# EasyEDA Pro project Utsuwa_project.epro

# Schematic Schematic1
Board Name: Board1; Create Date: 2025-12-11; Page Name: P1; Project Name: Utsuwa; Schematic Name: Schematic1; Update Date: 2025-12-11; Company: EasyEDA.com; Page Size: A4; Version: V1.0
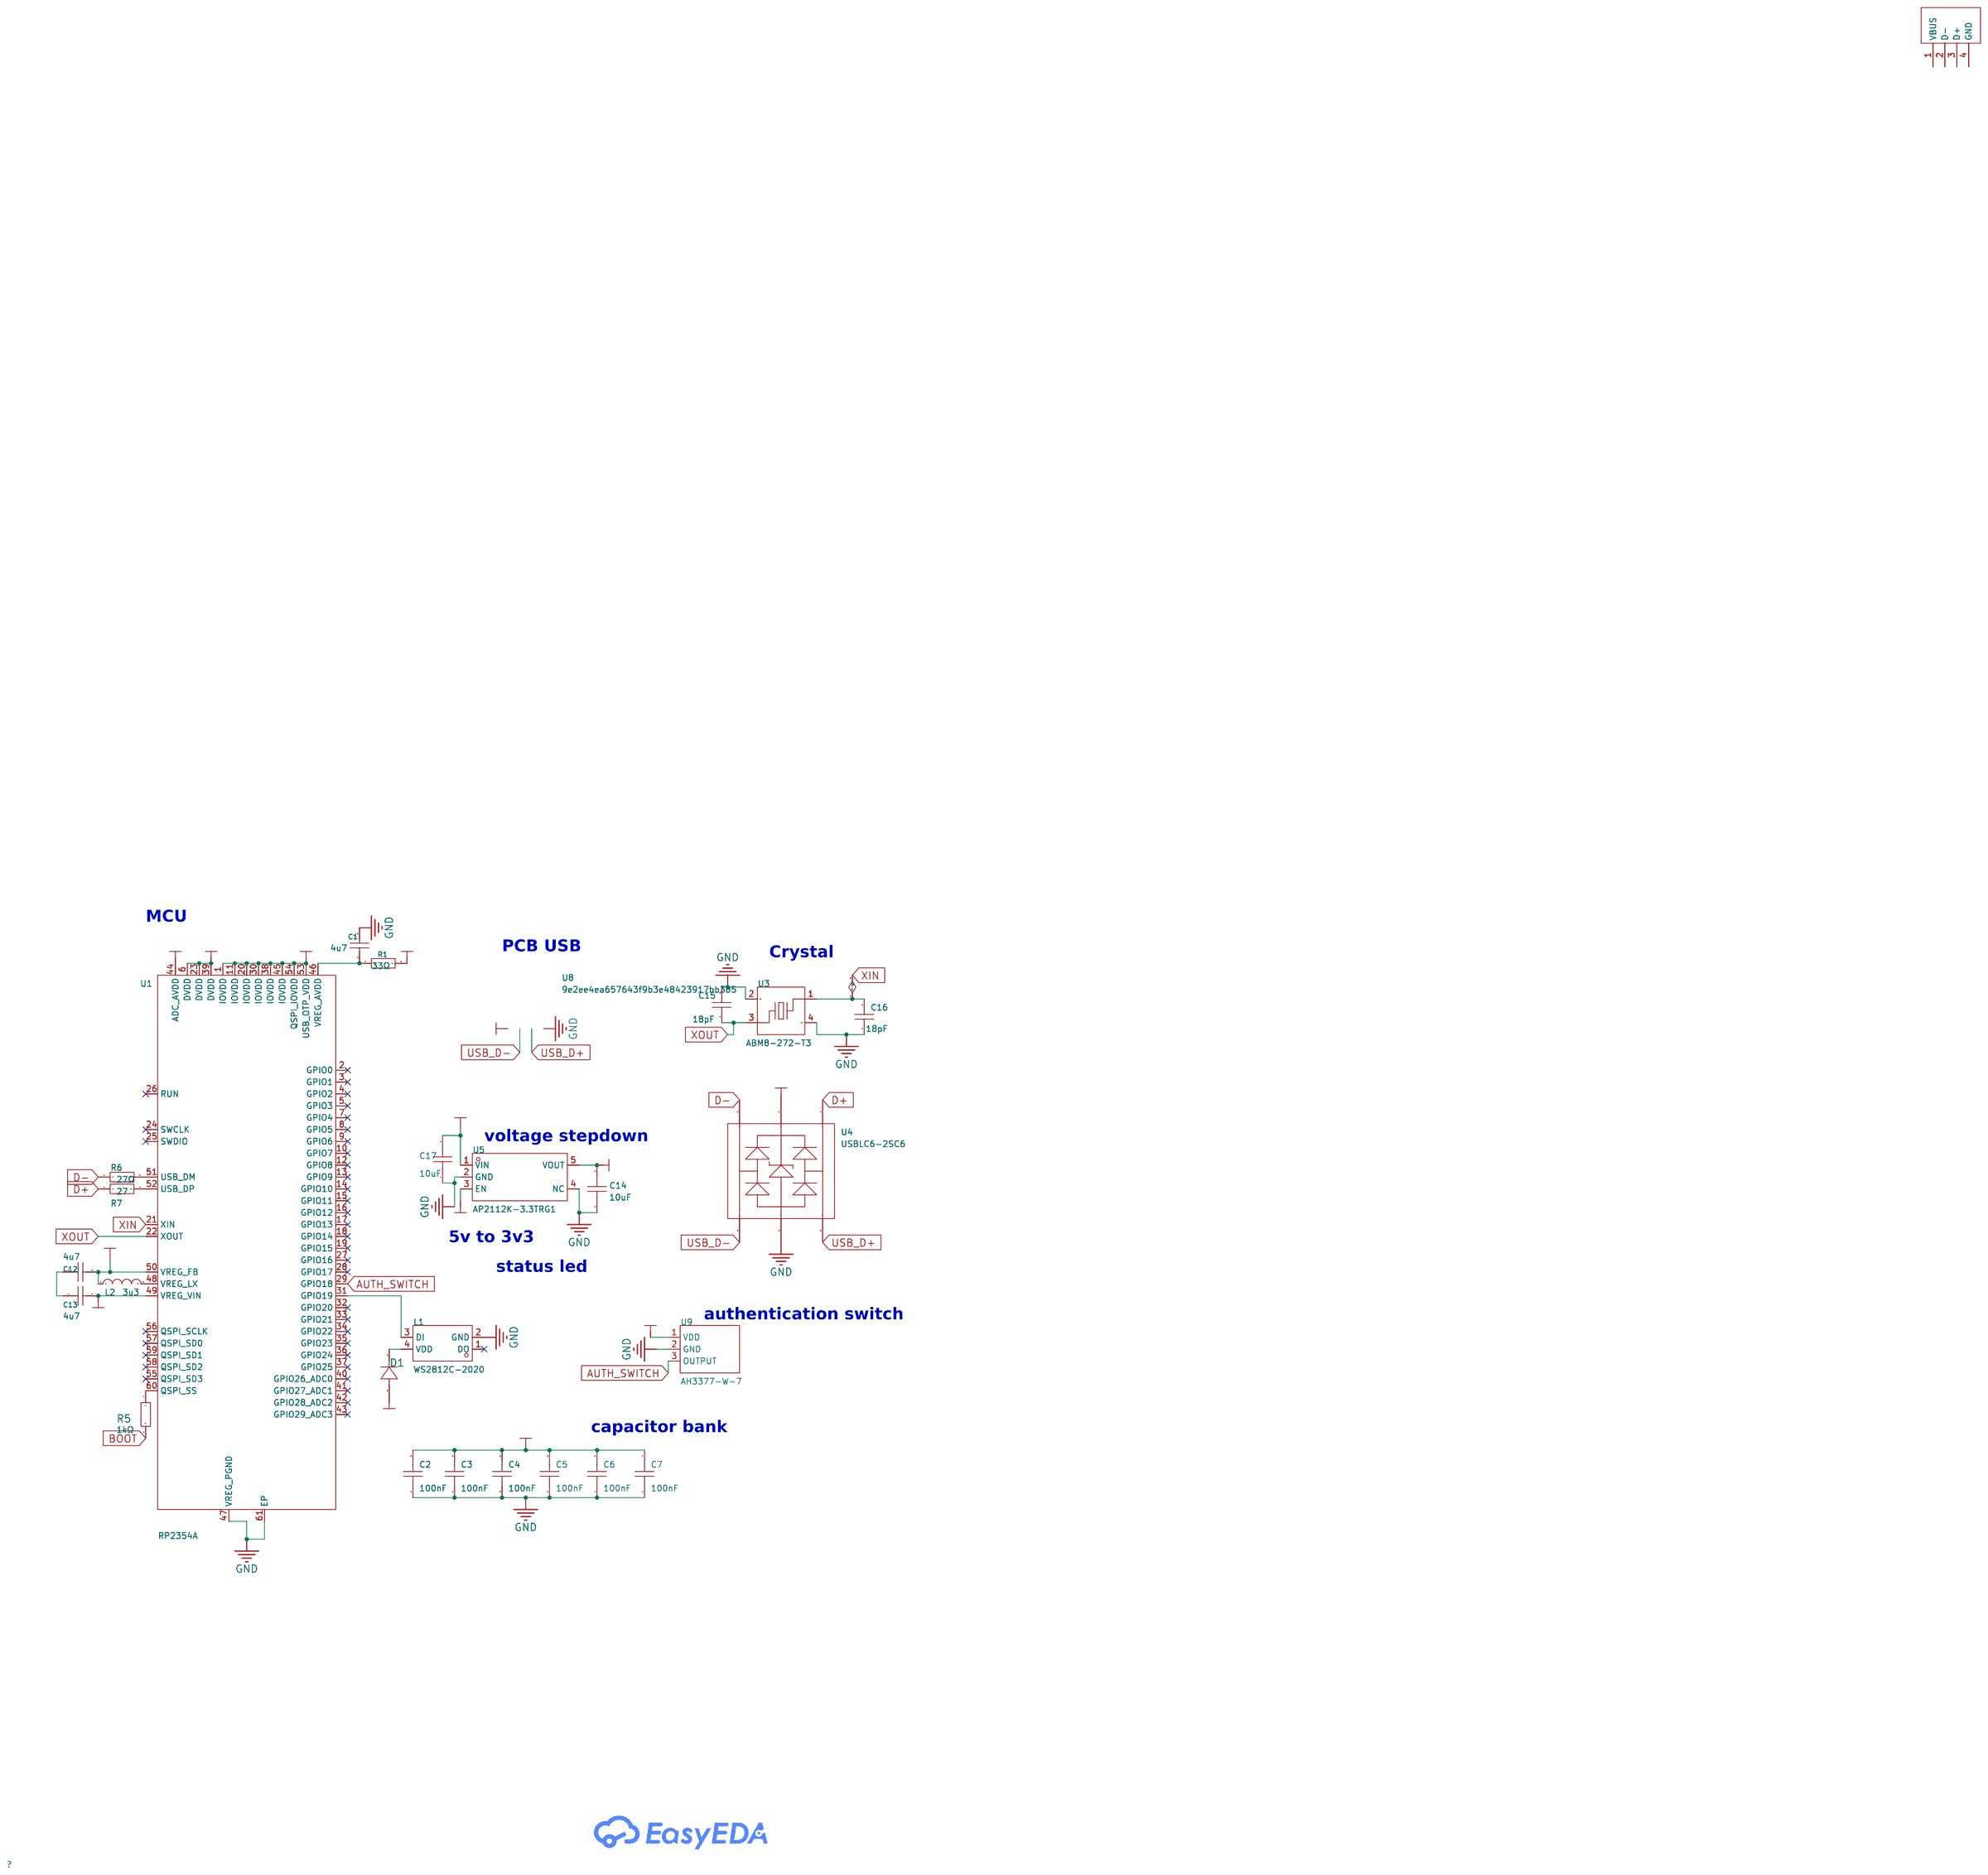
[diagram p0: schematic sheet]

## Parts
C1  4u7  [C0402_custom]
C2  100nF  [C0402_custom]
C3  100nF  [C0402_custom]
C4  100nF  [C0402_custom]
C5  100nF  [C0402_custom]
C6  100nF  [C0402_custom]
C7  100nF  [C0402_custom]
C12  4u7  [C0402_wider]
C13  4u7  [C0402_wider]
C14  10uF  [C0603]
C15  18pF  [C0402_custom]
C16  18pF  [C0402_custom]
C17  10uF  [C0603]
D1  1N4148WS  [SOD-323_L1.7-W1.3-LS2.7-RD]
L1  WS2812C-2020  [LED-SMD_L2.2-W2.0]
L2  3u3  [IND-SMD_L2.0-W1.6_AOTA-B201610S3R3-101-T]
R1  33Ω  [R0402]
R5  1kΩ  [R0402]
R6  27Ω  [R0402]
R7  27  [R0402]
U1  RP2354A  [QFN-60_L7.0-W7.0-P0.40-TL-EP3.4]
U3  ABM8-272-T3  [CRYSTAL-SMD_4P-L3.2-W2.5-BL]
U4  USBLC6-2SC6  [SOT-23-6_L2.9-W1.6-P0.95-LS2.8-BL]
U5  AP2112K-3.3TRG1  [SOT-25-5_L2.9-W1.6-P0.95-LS2.8-BL]
U8  9e2ee4ea657643f9b3e48423917bb385  [USB-A_PCB]
U9  AH3377-W-7  [SC-59-3_L3.0-W1.6-P0.95-LS2.9-BR-CW]

## Library data of the parts
C1 C12 C13 = CL05A475MP5NRNC: Capacitance:4.7uF Tolerance:±20% Tolerance:±20% Voltage Rating:10V Temperature Coefficient:X5R; LCSC Part Name: 4.7uF ±20% 10V; Supplier Part: C23733; Manufacturer: SAMSUNG(三星); Supplier Footprint: 0402; Datasheet: https://item.szlcsc.com/datasheet/CL05A475MP5NRNC/24469.html; Supplier: LCSC; Tolerance: ±20%; Voltage Rating: 10V; Temperature Coefficient: X5R
C2-C7 = CL05B104KO5NNNC: Capacitance:100nF Tolerance:±10% Tolerance:±10% Voltage Rating:16V Temperature Coefficient:X7R; LCSC Part Name: 100nF ±10% 16V; Supplier Part: C1525; Manufacturer: SAMSUNG(三星); Supplier Footprint: 0402; Datasheet: https://item.szlcsc.com/datasheet/CL05B104KO5NNNC/1877.html; Supplier: LCSC; Tolerance: ±10%; Voltage Rating: 16V; Temperature Coefficient: X7R
C14 C17 = CAP_0603: Supplier Footprint: 0603
C15 C16 = 0402CG150J500NT: Capacitance: Tolerance:±5% Tolerance:±5% Voltage Rated: Temperature Coefficient:; LCSC Part Name: 15pF ±5% 50V; Supplier Part: C1548; Manufacturer: FH(风华); Supplier Footprint: 0402; JLCPCB Part Class: Basic Part; Datasheet: https://atta.szlcsc.com/upload/public/pdf/source/20200305/C486355_26A10D38EF8C2A5C37091D0039909270.pdf; Supplier: LCSC; Tolerance: ±5%
D1 = 1N4148WS_C5381436: Voltage - DC Reverse(Vr):75V Current - Rectified:200mA; Supplier Part: C5381436; Manufacturer: FOSAN(富捷/富信); Supplier Footprint: SOD-323; JLCPCB Part Class: Extended Part; Datasheet: https://atta.szlcsc.com/upload/public/pdf/source/20230330/BED04A7599B1CD0FB6785C43972F2AE7.pdf; Supplier: LCSC; Voltage - DC Reverse(Vr): 75V; Current - Rectified: 200mA
L1 = WS2812C-2020: Wavelength:460nm；520nm；623nm Operating Temperature:-25℃~+85℃; Supplier Part: C965556; Manufacturer: worldsemi; Supplier Footprint: SMD,2x2mm; Datasheet: https://atta.szlcsc.com/upload/public/pdf/source/20201203/C965556_B52DCEA0E250ABD59F33ED24C4AD3075.pdf; Supplier: LCSC; Wavelength: 460nm；520nm；623nm; Operating Temperature: -25℃~+85℃
L2 = AOTA-B201610S3R3-101-T: Supplier Part: C42411119; Manufacturer: ABRACON; Supplier Footprint: 0806; Datasheet: https://item.szlcsc.com/datasheet/AOTA-B201610S3R3-101-T/44392932.html; Supplier: LCSC
R1 = 0402WGF330JTCE: Type:Thick Film Resistors Resistance:33Ω Tolerance:±1% Tolerance:±1% Power(Watts): Overload Voltage (Max): Temperature Coefficient:±100ppm/℃ Temperature Coefficient:±100ppm/℃ Operating Temperature Range:-55℃~+155℃ Operating Temperature Range:-55℃~+155℃; LCSC Part Name: 33Ω ±1% 62.5mW 厚膜电阻; Supplier Part: C25105; Manufacturer: UNI-ROYAL(厚声); Supplier Footprint: 0402; Datasheet: https://atta.szlcsc.com/upload/public/pdf/source/20200306/C422600_1E6D84923E4A46A82E41ADD87F860B5C.pdf; Supplier: LCSC; Type: Thick Film Resistors; Tolerance: ±1%; Temperature Coefficient: ±100ppm/℃; Operating Temperature Range: -55℃~+155℃
R5 = 0402WGF1001TCE: Type:Thick Film Resistors Resistance:1kΩ Tolerance:±1% Tolerance:±1% Power(Watts): Overload Voltage (Max): Temperature Coefficient:±100ppm/℃ Temperature Coefficient:±100ppm/℃ Operating Temperature Range:-55℃~+155℃ Operating Temperature Range:-55℃~+155℃; LCSC Part Name: 1kΩ ±1% 62.5mW 厚膜电阻; Supplier Part: C11702; Manufacturer: UNI-ROYAL(厚声); Supplier Footprint: 0402; JLCPCB Part Class: Basic Part; Datasheet: https://atta.szlcsc.com/upload/public/pdf/source/20200306/C422600_1E6D84923E4A46A82E41ADD87F860B5C.pdf; Supplier: LCSC; Type: Thick Film Resistors; Tolerance: ±1%; Temperature Coefficient: ±100ppm/℃; Operating Temperature Range: -55℃~+155℃
R6 = CR0402FF27R0G: Type:Thick Film Resistors Resistance: Tolerance:±1% Tolerance:±1% Power(Watts): Overload Voltage (Max): Temperature Coefficient:±200ppm/℃ Temperature Coefficient:±200ppm/℃ Operating Temperature Range:-55℃~+125℃ Operating Temperature Range:-55℃~+125℃; LCSC Part Name: 厚膜电阻 27Ω ±1% 62.5mW; Supplier Part: C100353; Manufacturer: LIZ(丽智电子); Supplier Footprint: 0402; JLCPCB Part Class: Extended Part; Datasheet: https://atta.szlcsc.com/upload/public/pdf/source/20180403/C189438_6D658388CC7843F35BBC9018D03F0B8E.pdf; Supplier: LCSC; Type: Thick Film Resistors; Tolerance: ±1%; Temperature Coefficient: ±200ppm/℃; Operating Temperature Range: -55℃~+125℃
R7 = Res_0603: Supplier Footprint: 0603
U1 = RP2354A: LCSC Part Name: 微控制器; Supplier Part: C41378174; Manufacturer: Raspberry Pi(树莓派); Supplier Footprint: QFN-60(7x7); Datasheet: https://item.szlcsc.com/datasheet/RP2354A/43147979.html; Supplier: LCSC
U3 = ABM8-272-T3_C20625731: Supplier Part: C20625731; Manufacturer: ABRACON; Supplier Footprint: SMD3225-4P; JLCPCB Part Class: Extended Part; Datasheet: https://item.szlcsc.com/datasheet/ABM8-272-T3/22032038.html; Supplier: LCSC
U4 = USBLC6-2SC6_C6807798: Polarity:Unidirectional Reverse Stand-Off Voltage (Vrwm):5V Clamping Voltage:10.4V Peak Pulse Current (Ipp):8A Peak Pulse Power Dissipation (Ppp):120W Voltage - Breakdown:9V Reverse Leakage Current (Ir):10nA Number of Channels:Three Channels Operating Tem; LCSC Part Name: 单向ESD; Supplier Part: C6807798; Manufacturer: FUXINSEMI(富芯森美); Supplier Footprint: SOT-23-6L; JLCPCB Part Class: Extended Part; Datasheet: https://atta.szlcsc.com/upload/public/pdf/source/20230621/E1164365F5EDB0C1523D3B709543B92D.pdf; Supplier: LCSC; Polarity: Unidirectional; Reverse Stand-Off Voltage (Vrwm): 5V; Clamping Voltage: 10.4V; Peak Pulse Current (Ipp): 8A; Peak Pulse Power Dissipation (Ppp): 120W; Voltage - Breakdown: 9V; Reverse Leakage Current (Ir): 10nA; Number of Channels: Three Channels; Operating Temperature: -55℃~+125℃; Type: ESD
U5 = AP2112K-3.3TRG1: Output Type:Fixed Maximum Input Voltage:6V Output Voltage:3.3V Output Voltage:3.3V Output Current:600mA Power Supply Rejection Ratio (PSRR):65dB@(1kHz) Dropout Voltage:400mV@(600mA) standby current:80uA Feature:ESD Protection；Automatic Discharge Function；; LCSC Part Name: 输入6V 输出3.3V 600mA; Supplier Part: C51118; Manufacturer: DIODES(美台); Supplier Footprint: SOT-25-5; JLCPCB Part Class: Extended Part; Datasheet: https://atta.szlcsc.com/upload/public/pdf/source/20171221/C51118_15138312998391195590.pdf; Supplier: LCSC; Output Type: Fixed; Maximum Input Voltage: 6V; Output Voltage: 3.3V; Output Current: 600mA; Power Supply Rejection Ratio (PSRR): 65dB@(1kHz); Dropout Voltage: 400mV@(600mA); standby current: 80uA; Feature: ESD Protection；Automatic Discharge Function；Low ESR；Thermal Protection(TSD)；Overcurrent Protection(OCP)；With ability; Operating Temperature: -40℃~+85℃; Output Polarity: Positive electrode; Number of Outputs: 1
U8 = USB-A_PCB
U9 = AH3377-W-7: Type:Unipolar Voltage - Supply:3V~28V Voltage - Supply:3V~28V Operation Points:11.5mT Operation Points:11.5mT Release Points:9mT Release Points:9mT Operating Temperature:-40℃~+125℃ Operating Temperature:-40℃~+125℃ Operating Current:3mA Output Type:Open Dr; LCSC Part Name: 高电压低灵敏度霍尔效应单极开关; Supplier Part: C842204; Manufacturer: DIODES(美台); Supplier Footprint: SC-59; JLCPCB Part Class: Extended Part; Datasheet: https://item.szlcsc.com/datasheet/AH3377-W-7/900535.html; Supplier: LCSC; Type: Unipolar; Voltage - Supply: 3V~28V; Operation Points: 11.5mT; Release Points: 9mT; Operating Temperature: -40℃~+125℃; Operating Current: 3mA; Output Type: Open Drain

## Nets
+1V1: C12.1 L2.1 U1.6(DVDD) U1.23(DVDD) U1.39(DVDD) U1.50(VREG_FB)
+3V3: C2.2 C3.2 C4.2 C5.2 C6.2 C7.2 C13.1 C14.1 R1.2 U1.1(IOVDD) U1.11(IOVDD) U1.20(IOVDD) U1.30(IOVDD) U1.38(IOVDD) U1.44(ADC_AVDD) U1.45(IOVDD) U1.49(VREG_VIN) U1.53(USB_OTP_VDD) U1.54(QSPI_IOVDD) U5.5(VOUT) U9.1(VDD)
GND: C1.1 C2.1 C3.1 C4.1 C5.1 C6.1 C7.1 C14.2 C15.2 C16.1 C17.1 L1.2(GND) U1.47(VREG_PGND) U1.61(EP) U3.2(GND) U3.4(GND) U4.2(GND) U5.2(GND) U5.4(NC) U9.2(GND)
VBUS: C17.2 D1.2(A) U4.5(VCC) U5.1(VIN) U5.3(EN)
AUTH_SWITCH: U1.29(GPIO18) U9.3(OUTPUT)
BOOT: R5.2
D+: R7.1 U4.4(I/O2)
D-: R6.1 U4.6(I/O1)
USB_D+: U4.3(I/O2)
USB_D-: U4.1(I/O1)
XIN: C16.2 U1.21(XIN) U3.1
XOUT: C15.1 U1.22(XOUT) U3.3
$1N2088: C1.2 R1.1 U1.46(VREG_AVDD)
$1N2309: C12.2 C13.2
$1N2310: L2.2 U1.48(VREG_LX)
$1N2528: R5.1 U1.60(QSPI_SS)
$1N2666: R6.2 U1.51(USB_DM)
$1N2692: R7.2 U1.52(USB_DP)
$1N3054: D1.1(C) L1.4(VDD)
$1N3383: L1.3(DI) U1.31(GPIO19)

Not connected (* = marked no-connect by the designer): L1 1(DO)*; U1 2(GPIO0)* 3(GPIO1)* 4(GPIO2)* 5(GPIO3)* 7(GPIO4)* 8(GPIO5)* 9(GPIO6)* 10(GPIO7)* 12(GPIO8)* 13(GPIO9)* 14(GPIO10)* 15(GPIO11)* 16(GPIO12)* 17(GPIO13)* 18(GPIO14)* 19(GPIO15)* 24(SWCLK)* 25(SWDIO)* 26(RUN)* 27(GPIO16)* 28(GPIO17)* 32(GPIO20)* 33(GPIO21)* 34(GPIO22)* 35(GPIO23)* 36(GPIO24)* 37(GPIO25)* 40(GPIO26_ADC0)* 41(GPIO27_ADC1)* 42(GPIO28_ADC2)* 43(GPIO29_ADC3)* 55(QSPI_SD3)* 56(QSPI_SCLK)* 57(QSPI_SD0)* 58(QSPI_SD2)* 59(QSPI_SD1)*; U8 1(VBUS) 2(D-) 3(D+) 4(GND)

## Notes on the sheet
- MCU
- PCB USB
- Crystal
- voltage stepdown
- 5v to 3v3
- status led
- authentication switch
- capacitor bank

# Board PCB1
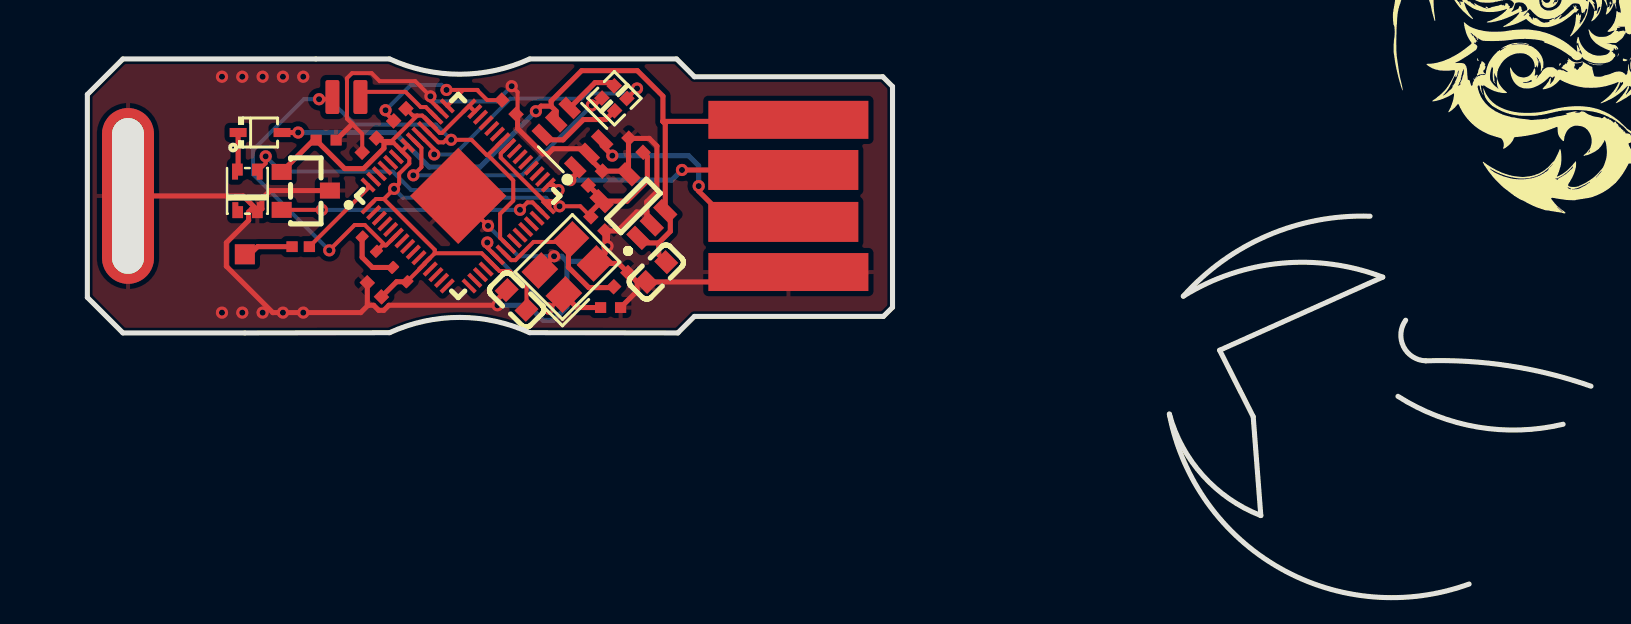
[diagram p1: board, top side]
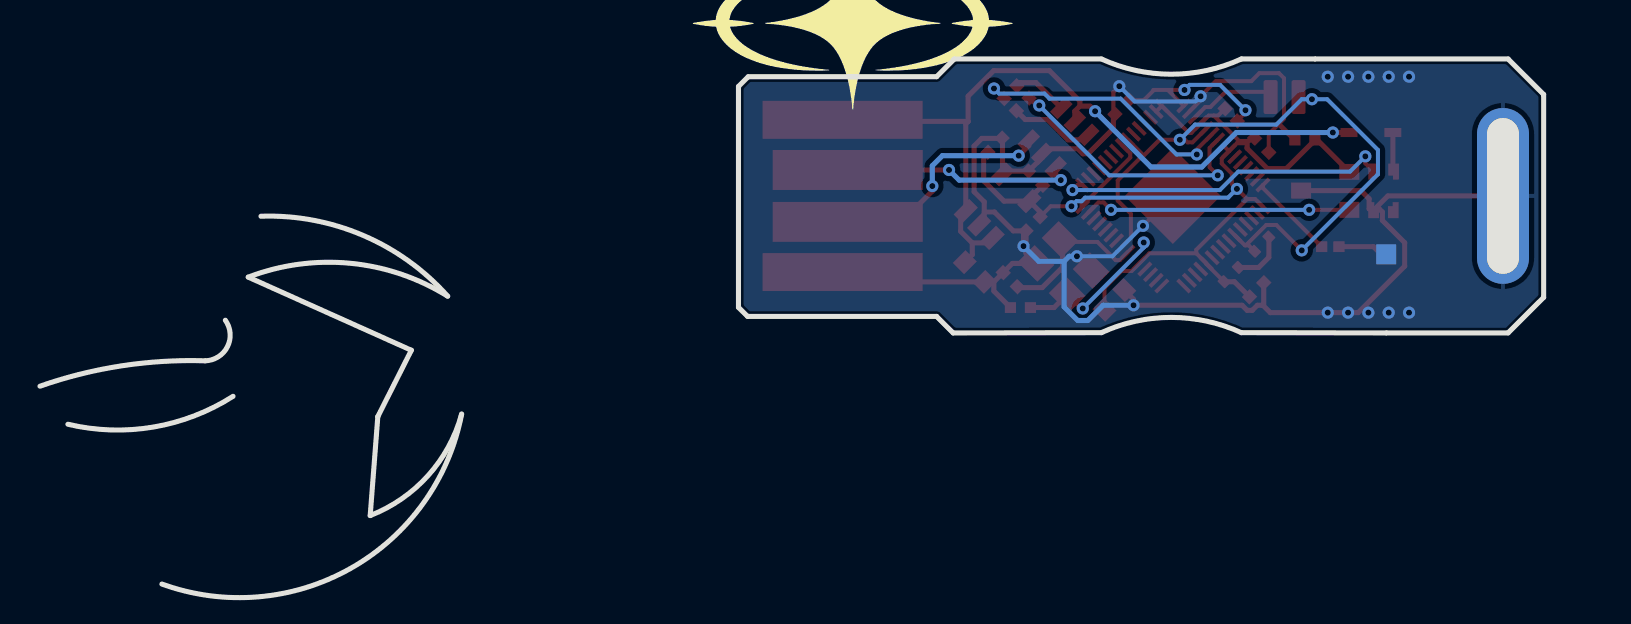
[diagram p2: board, bottom side, seen from below]

Outline 75.18 x 26.97 mm; copper layers: Top Layer, Bottom Layer. Coordinates in mm from the lower left corner of the outline.
Outline path: 64.14,19.1 arc(58.98,18.12) 54.8,15.09 arc(59.71,16.74) 64.77,16.05 56.62,12.39 58.29,9.06 58.67,4.11 arc(55.78,6.11) 54.1,9.19 arc(59.63,1.48) 69.09,0.68 ; 65.92,13.89 arc(65.81,12.57) 66.93,11.86 arc(71.11,11.6) 75.18,10.59 ; 73.79,8.68 arc(69.52,8.54) 65.53,10.08 ; 0,25.19 0,15.03 1.78,13.25 7.87,13.25 15.11,13.27 arc(18.61,14.03) 22.12,13.27 29.53,13.25 30.35,14.08 39.8,14.08 40.26,14.54 40.26,25.59 39.77,26.08 30.35,26.08 29.46,26.97 22.12,26.97 arc(18.61,26.2) 15.11,26.97 1.78,26.97 0,25.19
Stack: Top Layer 0.035mm / Dielectric1 1.51mm FR4 er 4.5 / Bottom Layer 0.035mm

## Design rules (mm)
template: JLCPCB Capability(Two Layers Board)
spacing copperThickness1oz (default): track to track 0.102, other pairs 0.152 to 0.3
spacing copperThickness2oz: track to track 0.203, other pairs 0.152 to 0.3
track width copperThickness1oz (default): min 0.127, default 0.254, max 2.54
track width copperThickness2oz: min 0.203, default 0.254, max 2.54
differential pair differentialPair (default): width min 0.127, default 0.254, max 2.54; gap min 0.152, default 0.152
via viaSize (default): diameter min 0.5, default 0.61, max 10; hole min 0.3, default 0.305, max 6.3

## Placement (name value [footprint] x y rotation side)
C1  4u7  [C0402_custom]  21.08 24.56 135 top
C2  100nF  [C0402_custom]  25.4 21 225 top
C3  100nF  [C0402_custom]  14.1 22.65 45 top
C4  100nF  [C0402_custom]  25.53 18.71 135 top
C5  100nF  [C0402_custom]  14.35 15.41 315 top
C6  100nF  [C0402_custom]  27.43 22.65 315 top
C7  100nF  [C0402_custom]  11.94 22.91 180 top
C12  4u7  [C0402_wider]  14.1 17.7 135 top
C13  4u7  [C0402_wider]  15.62 16.17 135 top
C14  10uF  [C0603]  21.46 14.9 135 top
C15  18pF  [C0402_custom]  26.67 15.92 45 top
C16  18pF  [C0402_custom]  26.16 14.52 180 top
C17  10uF  [C0603]  28.45 16.3 45 top
D1  1N4148WS  [SOD-323_L1.7-W1.3-LS2.7-RD]  8.64 23.29 0 top
L1  WS2812C-2020  [LED-SMD_L2.2-W2.0]  8 20.37 270 top
L2  3u3  [IND-SMD_L2.0-W1.6_AOTA-B201610S3R3-101-T]  12.95 25.06 0 top
NOREF  -  [Pad_e398]  7.87 17.19 0 top
NOREF#2  -  [Pad_e424]  2.03 20.11 90 top
R1  33Ω  [R0402]  15.62 24.18 45 top
R5  1kΩ  [R0402]  10.67 17.57 180 top
R6  27Ω  [R0402]  26.67 24.68 45 top
R7  27  [R0402]  26.03 25.32 225 top
U1  RP2354A  [QFN-60_L7.0-W7.0-P0.40-TL-EP3.4]  18.54 20.11 45 top
U3  ABM8-272-T3  [CRYSTAL-SMD_4P-L3.2-W2.5-BL]  24 16.56 45 top
U4  USBLC6-2SC6  [SOT-23-6_L2.9-W1.6-P0.95-LS2.8-BL]  24.26 23.03 45 top
U5  AP2112K-3.3TRG1  [SOT-25-5_L2.9-W1.6-P0.95-LS2.8-BL]  27.31 19.6 45 top
U8  9e2ee4ea657643f9b3e48423917bb385  [USB-A_PCB]  30.86 20.11 0 top
U9  AH3377-W-7  [SC-59-3_L3.0-W1.6-P0.95-LS2.9-BR-CW]  10.92 20.37 180 top

## Footprints (pads in the part's own frame, mm; a bottom-side part is the same pattern mirrored in y, then rotated)
C0402_custom
  rect 0.56x0.54 smd: 1(-0.5,0) 2(0.5,0)
C0402_wider
  rrect 0.45x0.53 smd: 1(-0.505,0) 2(0.505,0)
C0603
  rect 0.8x0.9 smd: 1(-0.7,0) 2(0.7,0)
CRYSTAL-SMD_4P-L3.2-W2.5-BL
  rect 1.4x1.2 smd: 1(-1.1,-0.85) 2(1.1,-0.85) 3(1.1,0.85) 4(-1.1,0.85)
IND-SMD_L2.0-W1.6_AOTA-B201610S3R3-101-T
  rrect 0.7x1.7 smd: 1(-0.7,0) 2(0.7,0)
LED-SMD_L2.2-W2.0
  custom 0.8x0.536 smd: 1(0.965,-0.485) 3(-0.966,0.5)
  custom 0.802x0.535 smd: 2(0.965,0.5)
  custom 0.8x0.535 smd: 4(-0.966,-0.5)
Pad_e398
  rect 1x1 hole 0.003: 8(0,0)
Pad_e424
  oval 8.8x2.6 hole 7.8x1.6: 8(0,0)
QFN-60_L7.0-W7.0-P0.40-TL-EP3.4
  rect 0.875x0.2 smd: 1(-3.575,2.8) 2(-3.575,2.4) 3(-3.575,2) 4(-3.575,1.6) 5(-3.575,1.2) 6(-3.575,0.8) 7(-3.575,0.4) 8(-3.575,0) 9(-3.575,-0.4) 10(-3.575,-0.8) 11(-3.575,-1.2) 12(-3.575,-1.6) 13(-3.575,-2) 14(-3.575,-2.4) 15(-3.575,-2.8) 31(3.575,-2.8) 32(3.575,-2.4) 33(3.575,-2.001) 34(3.575,-1.6) 35(3.575,-1.2) 36(3.575,-0.8) 37(3.575,-0.4) 38(3.575,-0.001) 39(3.575,0.4) 40(3.575,0.8) 41(3.575,1.2) 42(3.575,1.6) 43(3.575,2) 44(3.575,2.4) 45(3.575,2.8)
  rect 0.2x0.875 smd: 16(-2.8,-3.575) 17(-2.4,-3.575) 18(-2,-3.575) 19(-1.6,-3.575) 20(-1.2,-3.575) 21(-0.8,-3.575) 22(-0.4,-3.575) 23(0,-3.575) 24(0.4,-3.575) 25(0.8,-3.575) 26(1.2,-3.575) 27(1.6,-3.575) 28(2,-3.575) 29(2.4,-3.575) 30(2.8,-3.575) 46(2.8,3.575) 47(2.4,3.575) 48(2,3.575) 49(1.6,3.575) 50(1.2,3.575) 51(0.8,3.575) 52(0.4,3.575) 53(0,3.575) 54(-0.4,3.575) 55(-0.8,3.575) 56(-1.2,3.575) 57(-1.6,3.575) 58(-2,3.575) 59(-2.4,3.575) 60(-2.8,3.575)
  rect 3.4x3.4 smd: 61(0,0)
R0402
  rect 0.566x0.54 smd: 1(-0.433,0) 2(0.433,0)
SC-59-3_L3.0-W1.6-P0.95-LS2.9-BR-CW
  rect 1x0.8 smd: 1(1.206,-0.95) 2(-1.206,-0.015) 3(1.206,0.95)
SOD-323_L1.7-W1.3-LS2.7-RD
  rect 0.845x0.455 smd: 1(-1.097,0) 2(1.097,0)
SOT-23-6_L2.9-W1.6-P0.95-LS2.8-BL
  rect 0.532x1.072 smd: 1(-0.95,-1.149) 2(0,-1.149) 3(0.95,-1.149) 4(0.95,1.149) 5(0,1.149) 6(-0.95,1.149)
SOT-25-5_L2.9-W1.6-P0.95-LS2.8-BL
  rect 0.623x1.105 smd: 1(-0.95,-1.3) 2(-0.001,-1.3) 3(0.95,-1.3) 4(0.95,1.3) 5(-0.95,1.3)
USB-A_PCB
  rect 8x1.9 smd: 1(4.191,3.81) 4(4.191,-3.81)
  rect 7.5x2 smd: 2(3.937,1.3) 3(3.937,-1.3)

## Nets
+1V1: C12.1 L2.1 U1.6 U1.23 U1.39 U1.50
+3V3: C2.2 C3.2 C4.2 C5.2 C6.2 C7.2 C13.1 C14.1 R1.2 U1.1 U1.11 U1.20 U1.30 U1.38 U1.44 U1.45 U1.49 U1.53 U1.54 U5.5 U9.1
GND: C1.1 C2.1 C3.1 C4.1 C5.1 C6.1 C7.1 C14.2 C15.2 C16.1 C17.1 L1.2 NOREF#2.8 U1.47 U1.61 U3.2 U3.4 U4.2 U5.2 U5.4 U8.4 U9.2
VBUS: C17.2 D1.2 U4.5 U5.1 U5.3 U8.1
AUTH_SWITCH: U1.29 U9.3
BOOT: NOREF.8 R5.2
D+: R7.1 U4.4
D-: R6.1 U4.6
USB_D+: U4.3 U8.3
USB_D-: U4.1 U8.2
XIN: C16.2 U1.21 U3.1
XOUT: C15.1 U1.22 U3.3
$1N2088: C1.2 R1.1 U1.46
$1N2309: C12.2 C13.2
$1N2310: L2.2 U1.48
$1N2528: R5.1 U1.60
$1N2666: R6.2 U1.51
$1N2692: R7.2 U1.52
$1N3054: D1.1 L1.4
$1N3383: L1.3 U1.31

Pads without a net: L1 1; U1 2 3 4 5 7 8 9 10 12 13 14 15 16 17 18 19 24 25 26 27 28 32 33 34 35 36 37 40 41 42 43 55 56 57 58 59

## Via types
v1: diameter 0.61, hole 0.305, Top Layer to Bottom Layer, 39 vias

## Routing (per net, layer and track width the routed paths; a pad name or vN(x,y) marks a point on that pad's centre or on a via; arc(x,y) is an arc through that point)
+1V1: length 34.6
  Top Layer w0.2: v1(12.09,17.39) 13.36,18.66 13.87,18.66 14.89,17.64 ; 21.07,17.58 20.64,18.02 20.64,19.22 21.3,19.87 21.3,20.89 20.03,22.16 ; 20.03,22.16 U1.39 ; 20.03,22.16 19.97,22.16 19.21,22.92 17.94,22.92 17.81,22.79 17.56,22.79 U1.50 ; 14.89,17.64 14.75,17.64 14.45,17.34 ; 14.89,17.64 14.94,17.64 U1.6 ; v1(11.59,24.95) 12.14,24.95 L2.1
  Bottom Layer w0.2: v1(12.09,17.39) 8.28,21.2 8.28,22.41 10.82,24.95 v1(11.59,24.95) 12.09,24.95 13.36,23.68 17.43,23.68 v1(18.19,22.92)
+3V3: length 55.5
  Top Layer w0.2: 17.37,17.24 17.37,17.42 14.83,19.96 ; 17.37,17.24 U1.11 16.86,16.7 15.98,15.82 ; 17.37,17.24 19.72,17.24 U1.20 20.6,16.35 21.11,16.35 21.96,15.51 C14.1 ; U1.54 15.34,22.75 ; U1.54 16.01,22.64 ; U1.54 16.1,21.99 16.1,21.73 15.59,21.23 15.59,20.72 v1(15.34,20.46) 14.83,19.96 ; 15.34,22.75 14.83,22.75 ; 15.34,22.75 15.22,22.86 ; R1.2 16.27,24.13 16.49,24.13 ; 23.1,19.85 22.85,19.85 20.67,22.03 20.67,22.24 21.07,22.64 ; 23.1,19.85 23.36,19.85 v1(23.61,19.59) 24.65,19.59 C4.2 ; 23.1,19.85 23.1,19.62 U1.30 ; 17.11,23.77 U1.49 ; 17.11,23.77 17.62,23.26 17.73,23.26 19.09,24.62 U1.44 ; 17.11,23.77 16.75,24.13 16.49,24.13 ; 16.49,24.13 15.22,22.86 ; 14.03,19.56 14.43,19.96 14.83,19.96 ; 15.22,22.86 14.72,22.86 14.57,23 C3.2
  Top Layer w0.254: 25.71,19.85 25.71,19.98 C2.2 ; 25.71,19.85 26.98,19.85 28,20.87 28,22.08 C6.2 ; 25.71,19.85 25.17,19.31 C4.2 ; C5.2 15.46,15.82 15.98,15.82 ; 14.83,22.75 14.83,22.5 13.81,21.48 12.86,21.48 C7.2 11.31,22.91 U9.1
  Bottom Layer w0.2: v1(15.34,20.46) 15.78,20.03 22.92,20.03 23.1,19.85 23.36,19.85 v1(23.61,19.59)
GND: length 97.5
  Top Layer w0.2: C3.1 13.74,23.21 12.98,23.97 12.98,26.01 13.24,26.26 14.21,26.26 14.61,25.86 16.39,25.86 v1(17.15,25.1) 17.15,24.89 U1.47 ; v1(21.22,25.61) 21.51,25.31 21.51,24.12 ; v1(20.03,18.61) U1.61
  Top Layer w0.254: 28.22,18.68 27.97,18.94 27.97,19.31 ; 26.01,18.36 C4.1 25.88,17.23 U3.2 26.57,16.73 C15.2 27.49,15.81 ; 26.01,18.36 26.52,18.36 27.46,19.31 27.97,19.31 ; 26.01,18.36 v1(26.01,17.6) ; 27.49,15.81 C17.1 34.56,15.81 U8.4 ; 27.49,15.81 27.49,15.35 C16.1 ; C7.1 13.24,23.7 13.24,23.72 ; 14.05,14.65 14,14.7 C5.1 ; 14.05,14.65 14.06,14.64 14.32,14.64 14.57,14.38 14.82,14.38 15.08,14.64 v1(20.51,14.64) 20.51,14.94 C14.2 ; 14.05,14.65 13.67,14.27 v1(10.8,14.27) v1(9.78,14.27) 9.27,14.27 6.95,16.59 6.95,17.77 8.06,18.88 8.06,19.31 8.22,19.46 8.44,19.46 ; 8.44,19.46 8.56,19.46 ; 8.44,19.46 L1.2 8.56,19.46 ; 8.44,19.46 7.79,20.11 NOREF#2.8 ; 8.56,19.46 8.73,19.46 8.73,19.97 9.14,20.38 U9.2 ; 27.97,19.31 27.97,19.82 28.48,20.32 28.48,22.61 28.09,22.99 27.08,22.99 ; C1.1 21.51,24.12 21.51,23.49 22.78,22.22 23.04,22.22 23.29,22.47 24.82,22.47 U4.2 25.07,22.04 C2.1 26.9,21.35 U5.4 27.06,22.97 27.08,22.99 ; 27.08,22.99 C6.1 ; v1(23.34,17.09) 22.62,16.38
  Bottom Layer w0.2: v1(17.15,25.1) 17.41,24.84 20.46,24.84 v1(21.22,25.61) ; v1(20.03,18.61) 21.56,17.09 v1(23.34,17.09)
  Bottom Layer w0.254: v1(23.34,17.09) 23.72,17.09 23.97,16.84 ; 23.97,16.84 23.97,14.55 23.3,13.88 22.79,13.88 22.03,14.64 v1(20.51,14.64) ; 23.97,16.84 25.25,16.84 v1(26.01,17.6)
  vias: v1(6.73,26.08) v1(6.73,14.27) v1(7.75,26.08) v1(7.75,14.27) v1(8.76,26.08) v1(8.76,14.27) v1(9.78,26.08) v1(10.8,26.08)
VBUS: length 39.6
  Top Layer w0.254: 28.57,17.76 27.81,17.76 U5.1 ; 28.57,17.76 29.15,18.34 29.15,19.1 U5.3 28.9,23.72 28.78,23.84 28.78,23.84 ; 28.57,17.76 28.57,17.17 C17.2 ; U4.5 23.44,24.35 23.19,24.61 ; 28.78,23.84 28.78,25.11 27.5,26.38 24.71,26.38 23.19,24.86 23.19,24.61 ; 28.78,23.84 34.98,23.84 U8.1 ; 23.19,24.61 22.68,24.61 v1(22.43,24.35) ; v1(10.54,23.29) D1.2
  Bottom Layer w0.254: v1(22.43,24.35) 19.63,21.56 17.09,21.56 15.37,23.29 v1(10.54,23.29)
AUTH_SWITCH: length 13.4
  Top Layer w0.2: v1(21.63,19.42) 22,19.79 22.26,19.79 U1.29 ; v1(11.73,19.42) U9.3
  Bottom Layer w0.2: v1(21.63,19.42) v1(11.73,19.42)
BOOT: length 2.3
  Top Layer w0.254: 8.13,17.19 8.51,17.57 R5.2
D+: length 2.8
  Top Layer w0.254: R7.1 26.18,25.79 25.39,25.79 U4.4
D-: length 4.3
  Top Layer w0.254: 26.36,24.38 25.92,23.94 24.8,23.94 23.79,22.92 23.03,22.92 22.77,23.17
USB_D+: length 11.6
  Top Layer w0.254: 25.74,22.89 25.74,22.64 v1(26.25,22.13) ; v1(30.57,20.61) 30.57,20.35 32.09,18.83 34.78,18.83 34.8,18.81
  Bottom Layer w0.254: v1(26.25,22.13) 30.06,22.13 30.57,21.62 v1(30.57,20.61)
USB_D-: length 11.6
  Top Layer w0.254: v1(29.73,21.41) 34.8,21.41 ; U4.1 24.4,21.16 v1(24.14,20.9)
  Bottom Layer w0.254: v1(24.14,20.9) 29.22,20.9 v1(29.73,21.41)
XIN: length 8.7
  Top Layer w0.2: v1(23.04,14.48) 23.13,14.48 23.83,15.18 ; U1.21 20,17.53 v1(20,17.78)
  Top Layer w0.254: 23.83,15.18 24.48,14.52 C16.2
  Bottom Layer w0.2: v1(23.04,14.48) 20,17.53 v1(20,17.78)
XOUT: length 8
  Top Layer w0.2: 24.18,17.93 24.05,17.81 22.31,17.81 21.4,16.9 21.19,16.9 U1.22
  Top Layer w0.254: C15.1 26.27,15.52 25.07,15.52 24.05,16.54 24.05,17.81
$1N2088: length 8.5
  Top Layer w0.2: C1.2 19.99,24.91 19.48,25.42 ; U1.46 18.76,25.38 ; 19.48,25.42 v1(17.96,25.42) ; 19.48,25.42 19.52,25.42 ; 15.32,23.87 14.91,24.27 v1(14.91,24.4)
  Bottom Layer w0.2: v1(17.96,25.42) 17.7,25.67 16.18,25.67 v1(14.91,24.4)
$1N2309: length 2.8
  Top Layer w0.254: 15.26,16.53 14.25,16.53 13.74,17.04 13.74,18.06
$1N2310: length 4.4
  Top Layer w0.2: U1.48 16.92,24.56 16.67,24.56 15.9,25.32 13.91,25.32 L2.2
$1N2528: length 4.3
  Top Layer w0.2: 14.03,20.66 14.03,20.5 R5.1
$1N2666: length 13.6
  Top Layer w0.2: v1(17.34,22.19) 17.34,22.44 16.58,23.2 ; v1(27.48,25.49) R6.2
  Bottom Layer w0.2: v1(17.34,22.19) 18.36,22.19 21.15,24.98 24.71,24.98 24.96,25.24 27.23,25.24 v1(27.48,25.49)
$1N2692: length 13.1
  Top Layer w0.2: v1(16.3,21.14) 16.7,21.55 16.7,22.52 U1.52 ; R7.2 25.36,24.64 v1(25.22,24.64)
  Bottom Layer w0.2: v1(16.3,21.14) 21.72,21.14 v1(25.22,24.64)
$1N3054: length 2
  Top Layer w0.254: D1.1 7.54,21.37 L1.4
$1N3383: length 16.9
  Top Layer w0.2: L1.3 8.92,21.75 v1(8.92,22.09) ; v1(23.56,20.41) 23.3,20.66 23.05,20.66
  Bottom Layer w0.2: v1(8.92,22.09) 9.68,21.33 15.27,21.33 16.19,20.41 v1(23.56,20.41)

## Copper pours and planes (outline as drawn; the poured copper is in the pictures)
GND on Top Layer: -0.63,27.99 41.28,27.99 41.28,12.75 -0.63,12.75
GND on Bottom Layer: -0.63,27.99 41.28,27.99 41.28,12.75 -0.63,12.75
